# Altium schematic sheet Direction.SchDoc
size A4
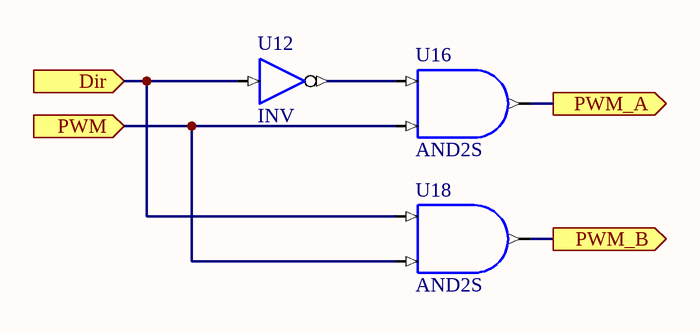
[diagram p0: Direction.SchDoc]

## Parts
U12  INV
U16  AND2S
U18  AND2S

## Ports
Dir (in), PWM (in), PWM_A (out), PWM_B (out)

## Nets
Dir: U12.I U18.I0 ; port Dir
PWM: U16.I1 U18.I1 ; port PWM
PWM_A: U16.O ; port PWM_A
PWM_B: U18.O ; port PWM_B
NetU12_O: U12.O U16.I0

## Library data of the parts
U12 = INV: Inverter; FunctionalClass: Logic Primitive; ArchiveName: GENERIC; VHDLIB_SIM: GENERIC_LIB; Published: 29-Jan-2004; Publisher: Altium Limited; XilinxEquivalent: INV; LastRevisionNo: 1.00.00; HelpURL: CR0118 FPGA Generic Library Guide.pdf#page=291; ComponentLink1URL: CR0136 FPGA Logic Primitive Resource Usage.pdf#page=61; ComponentLink1Description: Core &Resource Usage; SubClass: INV
U16 U18 = AND2: 2-Input AND Gate, Single Pin Version; XilinxEquivalent: AND2; FunctionalClass: Logic Primitive; PortSize: 2; ArchiveName: GENERIC; VHDLIB_SIM: GENERIC_LIB; Published: 29-Jan-2004; Publisher: Altium Limited; LastRevisionNo: 1.00.00; HelpURL: CR0118 FPGA Generic Library Guide.pdf#page=114; ComponentLink1URL: CR0136 FPGA Logic Primitive Resource Usage.pdf#page=13; ComponentLink1Description: Core &Resource Usage; SubClass: AND; PortStyle: Single Pin Version